# Altium schematic sheet backlight.SchDoc
size A3
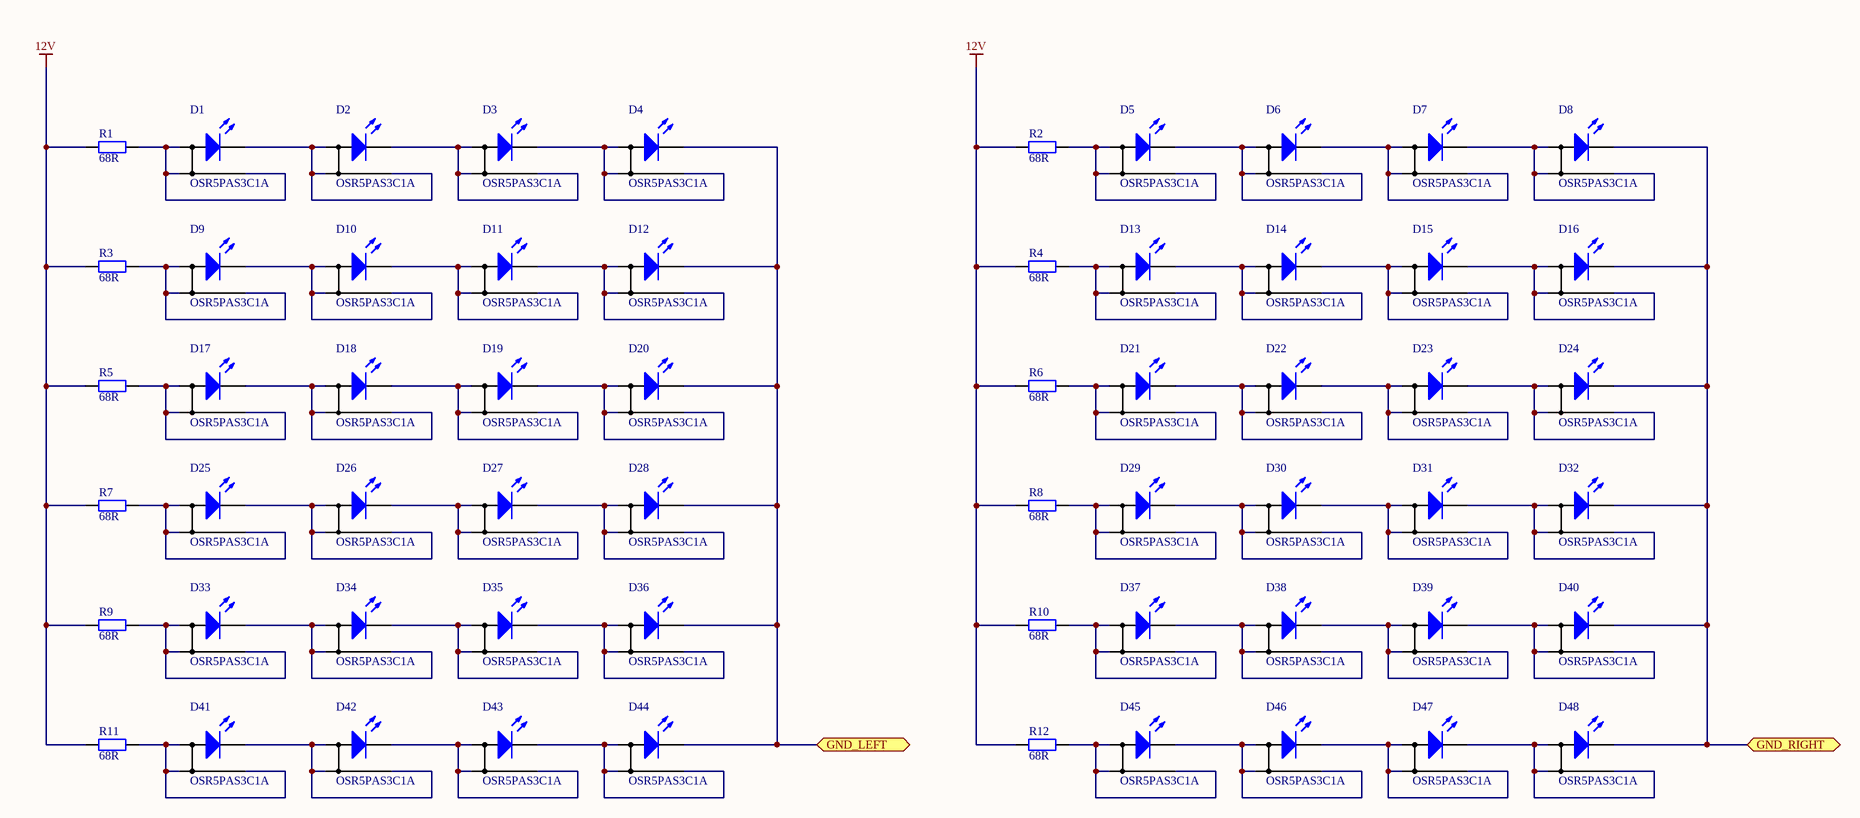
[diagram p0: backlight.SchDoc]

## Parts
D1  Value1: OSR5PAS3C1A  [DIO_Optosupply_OSR5PAS3C1A]  (hidden comment: DIO_LED_4pin_3528)
D2  Value1: OSR5PAS3C1A  [DIO_Optosupply_OSR5PAS3C1A]  (hidden comment: DIO_LED_4pin_3528)
D3  Value1: OSR5PAS3C1A  [DIO_Optosupply_OSR5PAS3C1A]  (hidden comment: DIO_LED_4pin_3528)
D4  Value1: OSR5PAS3C1A  [DIO_Optosupply_OSR5PAS3C1A]  (hidden comment: DIO_LED_4pin_3528)
D5  Value1: OSR5PAS3C1A  [DIO_Optosupply_OSR5PAS3C1A]  (hidden comment: DIO_LED_4pin_3528)
D6  Value1: OSR5PAS3C1A  [DIO_Optosupply_OSR5PAS3C1A]  (hidden comment: DIO_LED_4pin_3528)
D7  Value1: OSR5PAS3C1A  [DIO_Optosupply_OSR5PAS3C1A]  (hidden comment: DIO_LED_4pin_3528)
D8  Value1: OSR5PAS3C1A  [DIO_Optosupply_OSR5PAS3C1A]  (hidden comment: DIO_LED_4pin_3528)
D9  Value1: OSR5PAS3C1A  [DIO_Optosupply_OSR5PAS3C1A]  (hidden comment: DIO_LED_4pin_3528)
D10  Value1: OSR5PAS3C1A  [DIO_Optosupply_OSR5PAS3C1A]  (hidden comment: DIO_LED_4pin_3528)
D11  Value1: OSR5PAS3C1A  [DIO_Optosupply_OSR5PAS3C1A]  (hidden comment: DIO_LED_4pin_3528)
D12  Value1: OSR5PAS3C1A  [DIO_Optosupply_OSR5PAS3C1A]  (hidden comment: DIO_LED_4pin_3528)
D13  Value1: OSR5PAS3C1A  [DIO_Optosupply_OSR5PAS3C1A]  (hidden comment: DIO_LED_4pin_3528)
D14  Value1: OSR5PAS3C1A  [DIO_Optosupply_OSR5PAS3C1A]  (hidden comment: DIO_LED_4pin_3528)
D15  Value1: OSR5PAS3C1A  [DIO_Optosupply_OSR5PAS3C1A]  (hidden comment: DIO_LED_4pin_3528)
D16  Value1: OSR5PAS3C1A  [DIO_Optosupply_OSR5PAS3C1A]  (hidden comment: DIO_LED_4pin_3528)
D17  Value1: OSR5PAS3C1A  [DIO_Optosupply_OSR5PAS3C1A]  (hidden comment: DIO_LED_4pin_3528)
D18  Value1: OSR5PAS3C1A  [DIO_Optosupply_OSR5PAS3C1A]  (hidden comment: DIO_LED_4pin_3528)
D19  Value1: OSR5PAS3C1A  [DIO_Optosupply_OSR5PAS3C1A]  (hidden comment: DIO_LED_4pin_3528)
D20  Value1: OSR5PAS3C1A  [DIO_Optosupply_OSR5PAS3C1A]  (hidden comment: DIO_LED_4pin_3528)
D21  Value1: OSR5PAS3C1A  [DIO_Optosupply_OSR5PAS3C1A]  (hidden comment: DIO_LED_4pin_3528)
D22  Value1: OSR5PAS3C1A  [DIO_Optosupply_OSR5PAS3C1A]  (hidden comment: DIO_LED_4pin_3528)
D23  Value1: OSR5PAS3C1A  [DIO_Optosupply_OSR5PAS3C1A]  (hidden comment: DIO_LED_4pin_3528)
D24  Value1: OSR5PAS3C1A  [DIO_Optosupply_OSR5PAS3C1A]  (hidden comment: DIO_LED_4pin_3528)
D25  Value1: OSR5PAS3C1A  [DIO_Optosupply_OSR5PAS3C1A]  (hidden comment: DIO_LED_4pin_3528)
D26  Value1: OSR5PAS3C1A  [DIO_Optosupply_OSR5PAS3C1A]  (hidden comment: DIO_LED_4pin_3528)
D27  Value1: OSR5PAS3C1A  [DIO_Optosupply_OSR5PAS3C1A]  (hidden comment: DIO_LED_4pin_3528)
D28  Value1: OSR5PAS3C1A  [DIO_Optosupply_OSR5PAS3C1A]  (hidden comment: DIO_LED_4pin_3528)
D29  Value1: OSR5PAS3C1A  [DIO_Optosupply_OSR5PAS3C1A]  (hidden comment: DIO_LED_4pin_3528)
D30  Value1: OSR5PAS3C1A  [DIO_Optosupply_OSR5PAS3C1A]  (hidden comment: DIO_LED_4pin_3528)
D31  Value1: OSR5PAS3C1A  [DIO_Optosupply_OSR5PAS3C1A]  (hidden comment: DIO_LED_4pin_3528)
D32  Value1: OSR5PAS3C1A  [DIO_Optosupply_OSR5PAS3C1A]  (hidden comment: DIO_LED_4pin_3528)
D33  Value1: OSR5PAS3C1A  [DIO_Optosupply_OSR5PAS3C1A]  (hidden comment: DIO_LED_4pin_3528)
D34  Value1: OSR5PAS3C1A  [DIO_Optosupply_OSR5PAS3C1A]  (hidden comment: DIO_LED_4pin_3528)
D35  Value1: OSR5PAS3C1A  [DIO_Optosupply_OSR5PAS3C1A]  (hidden comment: DIO_LED_4pin_3528)
D36  Value1: OSR5PAS3C1A  [DIO_Optosupply_OSR5PAS3C1A]  (hidden comment: DIO_LED_4pin_3528)
D37  Value1: OSR5PAS3C1A  [DIO_Optosupply_OSR5PAS3C1A]  (hidden comment: DIO_LED_4pin_3528)
D38  Value1: OSR5PAS3C1A  [DIO_Optosupply_OSR5PAS3C1A]  (hidden comment: DIO_LED_4pin_3528)
D39  Value1: OSR5PAS3C1A  [DIO_Optosupply_OSR5PAS3C1A]  (hidden comment: DIO_LED_4pin_3528)
D40  Value1: OSR5PAS3C1A  [DIO_Optosupply_OSR5PAS3C1A]  (hidden comment: DIO_LED_4pin_3528)
D41  Value1: OSR5PAS3C1A  [DIO_Optosupply_OSR5PAS3C1A]  (hidden comment: DIO_LED_4pin_3528)
D42  Value1: OSR5PAS3C1A  [DIO_Optosupply_OSR5PAS3C1A]  (hidden comment: DIO_LED_4pin_3528)
D43  Value1: OSR5PAS3C1A  [DIO_Optosupply_OSR5PAS3C1A]  (hidden comment: DIO_LED_4pin_3528)
D44  Value1: OSR5PAS3C1A  [DIO_Optosupply_OSR5PAS3C1A]  (hidden comment: DIO_LED_4pin_3528)
D45  Value1: OSR5PAS3C1A  [DIO_Optosupply_OSR5PAS3C1A]  (hidden comment: DIO_LED_4pin_3528)
D46  Value1: OSR5PAS3C1A  [DIO_Optosupply_OSR5PAS3C1A]  (hidden comment: DIO_LED_4pin_3528)
D47  Value1: OSR5PAS3C1A  [DIO_Optosupply_OSR5PAS3C1A]  (hidden comment: DIO_LED_4pin_3528)
D48  Value1: OSR5PAS3C1A  [DIO_Optosupply_OSR5PAS3C1A]  (hidden comment: DIO_LED_4pin_3528)
R1  Value1: 68R  [RESC3116X65N]  (hidden comment: RES)
R2  Value1: 68R  [RESC3116X65N]  (hidden comment: RES)
R3  Value1: 68R  [RESC3116X65N]  (hidden comment: RES)
R4  Value1: 68R  [RESC3116X65N]  (hidden comment: RES)
R5  Value1: 68R  [RESC3116X65N]  (hidden comment: RES)
R6  Value1: 68R  [RESC3116X65N]  (hidden comment: RES)
R7  Value1: 68R  [RESC3116X65N]  (hidden comment: RES)
R8  Value1: 68R  [RESC3116X65N]  (hidden comment: RES)
R9  Value1: 68R  [RESC3116X65N]  (hidden comment: RES)
R10  Value1: 68R  [RESC3116X65N]  (hidden comment: RES)
R11  Value1: 68R  [RESC3116X65N]  (hidden comment: RES)
R12  Value1: 68R  [RESC3116X65N]  (hidden comment: RES)

## Ports
GND_LEFT, GND_RIGHT

## Nets
12V: R1.1 R2.1 R3.1 R4.1 R5.1 R6.1 R7.1 R8.1 R9.1 R10.1 R11.1 R12.1
GND_LEFT: D4.1(K) D12.1(K) D20.1(K) D28.1(K) D36.1(K) D44.1(K) ; port GND_LEFT
GND_RIGHT: D8.1(K) D16.1(K) D24.1(K) D32.1(K) D40.1(K) D48.1(K) ; port GND_RIGHT
NetD1_1: D1.1(K) D2.2 D2.3(A) D2.4
NetD1_2: D1.2 D1.3(A) D1.4 R1.2
NetD2_1: D2.1(K) D3.2 D3.3(A) D3.4
NetD3_1: D3.1(K) D4.2 D4.3(A) D4.4
NetD5_1: D5.1(K) D6.2 D6.3(A) D6.4
NetD5_2: D5.2 D5.3(A) D5.4 R2.2
NetD6_1: D6.1(K) D7.2 D7.3(A) D7.4
NetD7_1: D7.1(K) D8.2 D8.3(A) D8.4
NetD9_1: D9.1(K) D10.2 D10.3(A) D10.4
NetD9_2: D9.2 D9.3(A) D9.4 R3.2
NetD10_1: D10.1(K) D11.2 D11.3(A) D11.4
NetD11_1: D11.1(K) D12.2 D12.3(A) D12.4
NetD13_1: D13.1(K) D14.2 D14.3(A) D14.4
NetD13_2: D13.2 D13.3(A) D13.4 R4.2
NetD14_1: D14.1(K) D15.2 D15.3(A) D15.4
NetD15_1: D15.1(K) D16.2 D16.3(A) D16.4
NetD17_1: D17.1(K) D18.2 D18.3(A) D18.4
NetD17_2: D17.2 D17.3(A) D17.4 R5.2
NetD18_1: D18.1(K) D19.2 D19.3(A) D19.4
NetD19_1: D19.1(K) D20.2 D20.3(A) D20.4
NetD21_1: D21.1(K) D22.2 D22.3(A) D22.4
NetD21_2: D21.2 D21.3(A) D21.4 R6.2
NetD22_1: D22.1(K) D23.2 D23.3(A) D23.4
NetD23_1: D23.1(K) D24.2 D24.3(A) D24.4
NetD25_1: D25.1(K) D26.2 D26.3(A) D26.4
NetD25_2: D25.2 D25.3(A) D25.4 R7.2
NetD26_1: D26.1(K) D27.2 D27.3(A) D27.4
NetD27_1: D27.1(K) D28.2 D28.3(A) D28.4
NetD29_1: D29.1(K) D30.2 D30.3(A) D30.4
NetD29_2: D29.2 D29.3(A) D29.4 R8.2
NetD30_1: D30.1(K) D31.2 D31.3(A) D31.4
NetD31_1: D31.1(K) D32.2 D32.3(A) D32.4
NetD33_1: D33.1(K) D34.2 D34.3(A) D34.4
NetD33_2: D33.2 D33.3(A) D33.4 R9.2
NetD34_1: D34.1(K) D35.2 D35.3(A) D35.4
NetD35_1: D35.1(K) D36.2 D36.3(A) D36.4
NetD37_1: D37.1(K) D38.2 D38.3(A) D38.4
NetD37_2: D37.2 D37.3(A) D37.4 R10.2
NetD38_1: D38.1(K) D39.2 D39.3(A) D39.4
NetD39_1: D39.1(K) D40.2 D40.3(A) D40.4
NetD41_1: D41.1(K) D42.2 D42.3(A) D42.4
NetD41_2: D41.2 D41.3(A) D41.4 R11.2
NetD42_1: D42.1(K) D43.2 D43.3(A) D43.4
NetD43_1: D43.1(K) D44.2 D44.3(A) D44.4
NetD45_1: D45.1(K) D46.2 D46.3(A) D46.4
NetD45_2: D45.2 D45.3(A) D45.4 R12.2
NetD46_1: D46.1(K) D47.2 D47.3(A) D47.4
NetD47_1: D47.1(K) D48.2 D48.3(A) D48.4

## Library data of the parts
D1-D48 = 03_00092: High Luminous PLCC4 Power Top SMD LED; Manufacturer: OptoSupply; AutoId: 108; Value2: 2..2,8V 50mA 1560-1800 mcd; DeviceType: diode; Id: 03_00092; Value3: LED; Manufacturer PN: OSR5PAS3C1A; SubType: LED; Status: 0 - Unchecked; MountType: SMD; ComponentLink1Description: Datasheet; ComponentLink1URL: X:\01_Datasheets\DIO_Optosupply_OSR5PAS3C1A.pdf; ComponentLink2Description: ComponentVerificationSheet; ComponentLink2URL: X:\02_ComponentVerificationSheets\; Supplier 1: rcs; Supplier Part Number 1: 139993
R1-R12 = 15_00388: 1% SMT Resistor 1206; Manufacturer: Yageo; Manufacturer PN: RC1206FR-0768R; AutoId: 388; Value2: 0W25; SubType: Metal film; Id: 15_00388; DeviceType: resistor; Status: 0 - Unchecked; MountType: SMT; ComponentLink1Description: Datasheet; ComponentLink1URL: X:\01_Datasheets\RES_YAGEO_RC1206FR.pdf; Supplier 1: Farnell